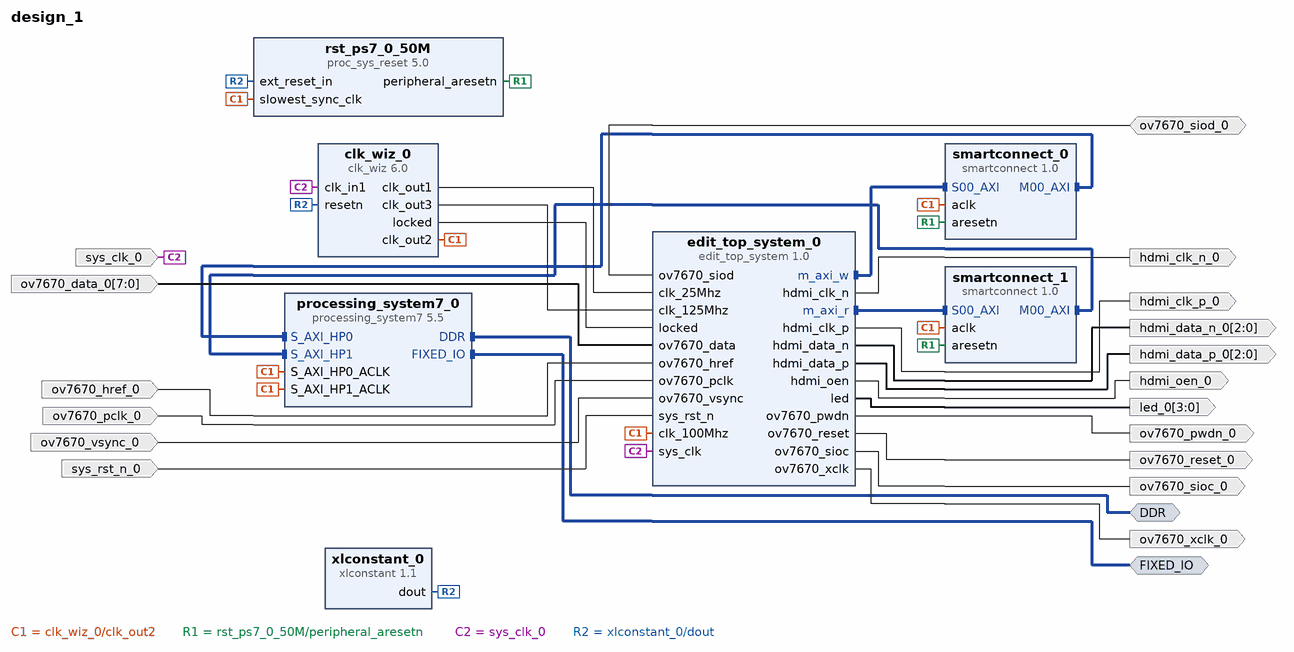
[diagram p0: block diagram of the top level]
# Vivado block design design_1, xc7z010clg400-1, Vivado 2025.1
create_bd_design design_1

create_bd_intf_port -mode Master -vlnv xilinx.com:interface:ddrx_rtl:1.0 DDR
create_bd_intf_port -mode Master -vlnv xilinx.com:display_processing_system7:fixedio_rtl:1.0 FIXED_IO
create_bd_port -dir I -type rst sys_rst_n_0
create_bd_port -dir I ov7670_pclk_0
create_bd_port -dir I ov7670_vsync_0
create_bd_port -dir I ov7670_href_0
create_bd_port -dir I -type clk sys_clk_0
set_property -dict {CONFIG.FREQ_HZ 50000000} [get_bd_ports sys_clk_0]
create_bd_port -dir I -from 7 -to 0 ov7670_data_0
create_bd_port -dir O ov7670_sioc_0
create_bd_port -dir O -from 2 -to 0 hdmi_data_p_0
create_bd_port -dir O hdmi_oen_0
create_bd_port -dir O -type clk hdmi_clk_p_0
create_bd_port -dir O -from 3 -to 0 led_0
create_bd_port -dir IO ov7670_siod_0
create_bd_port -dir O ov7670_pwdn_0
create_bd_port -dir O -type clk hdmi_clk_n_0
create_bd_port -dir O -type rst ov7670_reset_0
create_bd_port -dir O ov7670_xclk_0
create_bd_port -dir O -from 2 -to 0 hdmi_data_n_0

create_bd_cell -type ip -vlnv xilinx.com:ip:processing_system7:5.5 processing_system7_0
set_property -dict [list \
  CONFIG.PCW_UART1_PERIPHERAL_ENABLE 1 \
  CONFIG.PCW_UART1_UART1_IO {MIO 48 .. 49} \
  CONFIG.PCW_UART_PERIPHERAL_FREQMHZ 100 \
  CONFIG.PCW_UIPARAM_DDR_PARTNO {MT41J128M16 HA-125} \
  CONFIG.PCW_USE_M_AXI_GP0 0 \
  CONFIG.PCW_USE_S_AXI_HP0 1 \
  CONFIG.PCW_USE_S_AXI_HP1 1 \
] [get_bd_cells processing_system7_0]
# 44 more settings of processing_system7_0 are not shown: defaults, MIO pin electricals, DDR timing, and values the tool derives
create_bd_cell -type ip -vlnv xilinx.com:ip:proc_sys_reset:5.0 rst_ps7_0_50M
create_bd_cell -type ip -vlnv xilinx.com:ip:xlconstant:1.1 xlconstant_0
create_bd_cell -type ip -vlnv xilinx.com:user:edit_top_system:1.0 edit_top_system_0
create_bd_cell -type ip -vlnv xilinx.com:ip:smartconnect:1.0 smartconnect_0
create_bd_cell -type ip -vlnv xilinx.com:ip:smartconnect:1.0 smartconnect_1
create_bd_cell -type ip -vlnv xilinx.com:ip:clk_wiz:6.0 clk_wiz_0
set_property -dict [list \
  CONFIG.CLKIN1_JITTER_PS 200.0 \
  CONFIG.CLKOUT1_JITTER 236.428 \
  CONFIG.CLKOUT1_PHASE_ERROR 164.985 \
  CONFIG.CLKOUT1_REQUESTED_OUT_FREQ 25 \
  CONFIG.CLKOUT2_JITTER 162.035 \
  CONFIG.CLKOUT2_PHASE_ERROR 164.985 \
  CONFIG.CLKOUT2_USED true \
  CONFIG.CLKOUT3_JITTER 154.207 \
  CONFIG.CLKOUT3_PHASE_ERROR 164.985 \
  CONFIG.CLKOUT3_REQUESTED_OUT_FREQ 125 \
  CONFIG.CLKOUT3_USED true \
  CONFIG.MMCM_CLKFBOUT_MULT_F 20.000 \
  CONFIG.MMCM_CLKIN1_PERIOD 20.000 \
  CONFIG.MMCM_CLKIN2_PERIOD 10.0 \
  CONFIG.MMCM_CLKOUT0_DIVIDE_F 40.000 \
  CONFIG.MMCM_CLKOUT1_DIVIDE 10 \
  CONFIG.MMCM_CLKOUT2_DIVIDE 8 \
  CONFIG.NUM_OUT_CLKS 3 \
  CONFIG.PRIM_IN_FREQ 50.000 \
  CONFIG.RESET_PORT resetn \
  CONFIG.RESET_TYPE ACTIVE_LOW \
] [get_bd_cells clk_wiz_0]

# ---- connections ----

connect_bd_intf_net [get_bd_intf_pins edit_top_system_0/m_axi_r] [get_bd_intf_pins smartconnect_1/S00_AXI]
connect_bd_intf_net [get_bd_intf_pins edit_top_system_0/m_axi_w] [get_bd_intf_pins smartconnect_0/S00_AXI]
connect_bd_intf_net [get_bd_intf_ports DDR] [get_bd_intf_pins processing_system7_0/DDR]
connect_bd_intf_net [get_bd_intf_ports FIXED_IO] [get_bd_intf_pins processing_system7_0/FIXED_IO]
connect_bd_intf_net [get_bd_intf_pins smartconnect_0/M00_AXI] [get_bd_intf_pins processing_system7_0/S_AXI_HP0]
connect_bd_intf_net [get_bd_intf_pins smartconnect_1/M00_AXI] [get_bd_intf_pins processing_system7_0/S_AXI_HP1]
connect_bd_net [get_bd_ports ov7670_siod_0] [get_bd_pins edit_top_system_0/ov7670_siod]
connect_bd_net [get_bd_pins clk_wiz_0/clk_out1] [get_bd_pins edit_top_system_0/clk_25Mhz]
connect_bd_net [get_bd_pins clk_wiz_0/clk_out2] \
  [get_bd_pins rst_ps7_0_50M/slowest_sync_clk] [get_bd_pins smartconnect_0/aclk] [get_bd_pins smartconnect_1/aclk] \
  [get_bd_pins processing_system7_0/S_AXI_HP0_ACLK] [get_bd_pins processing_system7_0/S_AXI_HP1_ACLK] \
  [get_bd_pins edit_top_system_0/clk_100Mhz]
connect_bd_net [get_bd_pins clk_wiz_0/clk_out3] [get_bd_pins edit_top_system_0/clk_125Mhz]
connect_bd_net [get_bd_pins clk_wiz_0/locked] [get_bd_pins edit_top_system_0/locked]
connect_bd_net [get_bd_pins edit_top_system_0/hdmi_clk_n] [get_bd_ports hdmi_clk_n_0]
connect_bd_net [get_bd_pins edit_top_system_0/hdmi_clk_p] [get_bd_ports hdmi_clk_p_0]
connect_bd_net [get_bd_pins edit_top_system_0/hdmi_data_n] [get_bd_ports hdmi_data_n_0]
connect_bd_net [get_bd_pins edit_top_system_0/hdmi_data_p] [get_bd_ports hdmi_data_p_0]
connect_bd_net [get_bd_pins edit_top_system_0/hdmi_oen] [get_bd_ports hdmi_oen_0]
connect_bd_net [get_bd_pins edit_top_system_0/led] [get_bd_ports led_0]
connect_bd_net [get_bd_pins edit_top_system_0/ov7670_pwdn] [get_bd_ports ov7670_pwdn_0]
connect_bd_net [get_bd_pins edit_top_system_0/ov7670_reset] [get_bd_ports ov7670_reset_0]
connect_bd_net [get_bd_pins edit_top_system_0/ov7670_sioc] [get_bd_ports ov7670_sioc_0]
connect_bd_net [get_bd_pins edit_top_system_0/ov7670_xclk] [get_bd_ports ov7670_xclk_0]
connect_bd_net -net ov7670_data_0_1 [get_bd_ports ov7670_data_0] [get_bd_pins edit_top_system_0/ov7670_data]
connect_bd_net -net ov7670_href_0_1 [get_bd_ports ov7670_href_0] [get_bd_pins edit_top_system_0/ov7670_href]
connect_bd_net -net ov7670_pclk_0_1 [get_bd_ports ov7670_pclk_0] [get_bd_pins edit_top_system_0/ov7670_pclk]
connect_bd_net -net ov7670_vsync_0_1 [get_bd_ports ov7670_vsync_0] [get_bd_pins edit_top_system_0/ov7670_vsync]
connect_bd_net [get_bd_pins rst_ps7_0_50M/peripheral_aresetn] [get_bd_pins smartconnect_0/aresetn] [get_bd_pins smartconnect_1/aresetn]
connect_bd_net -net sys_clk_0_1 [get_bd_ports sys_clk_0] [get_bd_pins clk_wiz_0/clk_in1] [get_bd_pins edit_top_system_0/sys_clk]
connect_bd_net -net sys_rst_n_0_1 [get_bd_ports sys_rst_n_0] [get_bd_pins edit_top_system_0/sys_rst_n]
connect_bd_net [get_bd_pins xlconstant_0/dout] [get_bd_pins rst_ps7_0_50M/ext_reset_in] [get_bd_pins clk_wiz_0/resetn]

# ---- address map ----
assign_bd_address -offset 0x00000000 -range 256M -target_address_space [get_bd_addr_spaces edit_top_system_0/m_axi_r] [get_bd_addr_segs processing_system7_0/S_AXI_HP1/HP1_DDR_LOWOCM]
assign_bd_address -offset 0x00000000 -range 256M -target_address_space [get_bd_addr_spaces edit_top_system_0/m_axi_w] [get_bd_addr_segs processing_system7_0/S_AXI_HP0/HP0_DDR_LOWOCM]

validate_bd_design
save_bd_design
